# EAGLE design Dimmer_atmega328 (EAGLE 6.1)

## Sheet 1 of 4
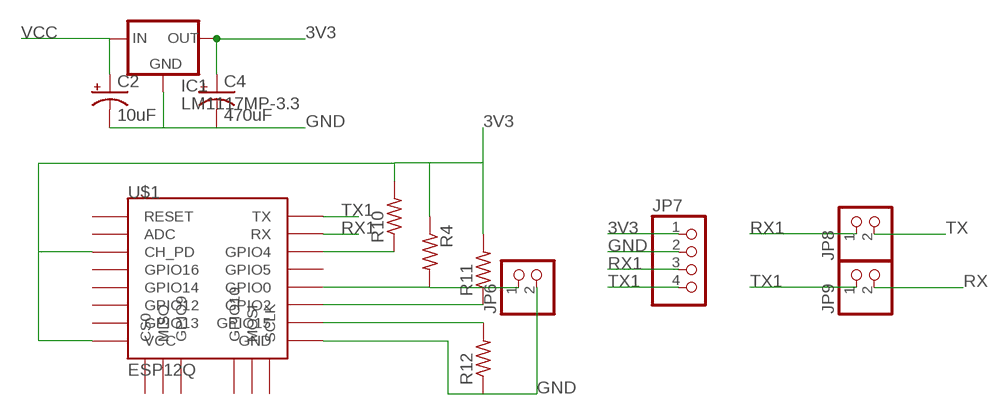
[diagram p0: schematic, sheet 1]

### Parts
C2  10uF  CPOL-USE2.5-6  [E2,5-6]
C4  470uF  CPOL-USE5-8.5  [E5-8,5]
IC1  LM1117MP-3.3  [SOT223]
JP6  PINHD-1X2  [1X02]
JP7  PINHD-1X4  [1X04]
JP8  PINHD-1X2  [1X02]
JP9  PINHD-1X2  [1X02]
R4  R-US_0207/10  [0207/10]
R10  R-US_0207/10  [0207/10]
R11  R-US_0207/10  [0207/10]
R12  R-US_0207/10  [0207/10]
U$1  ESP12Q  [ESP12Q]

### Nets
3V3: C4.+ IC1.2(OUT) IC1.4(OUT) JP7.1 R4.1 R10.2 R11.2 U$1.CH_PD U$1.VCC
GND: C2.- C4.- IC1.1(GND) JP6.2 JP7.2 R12.1 U$1.GND ; also sheet 2,3,4
N$10: JP6.1 R4.2 U$1.GPIO0
N$11: R10.1 U$1.GPIO4
N$21: R11.1 U$1.GPIO2
N$22: R12.2 U$1.GPIO15
RX: JP9.2 ; also sheet 2
RX1: JP7.3 JP8.1 U$1.RX
TX: JP8.2 ; also sheet 2
TX1: JP7.4 JP9.1 U$1.TX
VCC: C2.+ IC1.3(IN) ; also sheet 2,3
Unconnected: U$1.ADC U$1.CS0 U$1.GPIO5 U$1.GPIO9 U$1.GPIO10 U$1.GPIO12 U$1.GPIO13 U$1.GPIO14 U$1.GPIO16 U$1.MISO U$1.MOSI U$1.RESET U$1.SCLK

## Sheet 2 of 4: controller
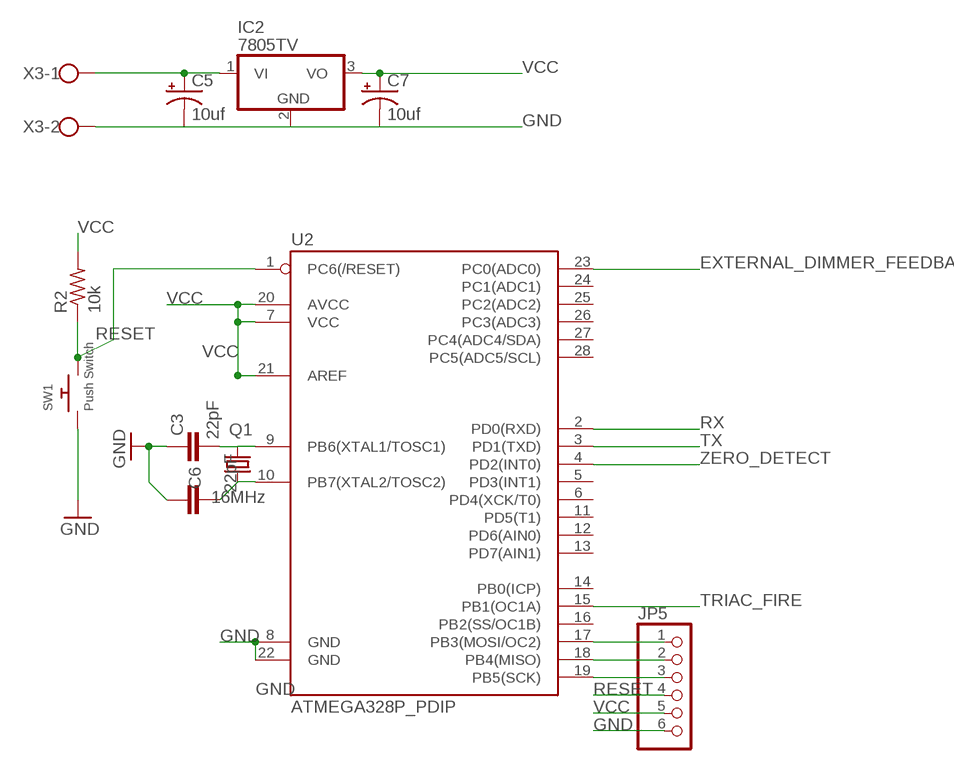
[diagram p1: schematic, sheet 2]

### Parts
C3  22pF  CAPPTH  [CAP-PTH-SMALL]
C5  10uf  CPOL-USE2.5-6  [E2,5-6]
C6  22pF  CAPPTH  [CAP-PTH-SMALL]
C7  10uf  CPOL-USE2.5-6  [E2,5-6]
IC2  7805TV  [TO220V]
JP5  PINHD-1X6  [1X06]
Q1  16MHz  CRYSTALHC49US  [HC49US]
R2  10k  R-US_0207/10  [0207/10]
SW1  Push Switch  SWITCH_PUSHBUTTONEVQ-PE  [TACT_PANA-EVQ]
U2  ATMEGA328P_PDIP  [DIL28-3]
X3  W237-102  [W237-102]

### Nets
EXTERNAL_DIMMER_FEEDBACK: U2.23(PC0(ADC0)) ; also sheet 4
GND: C3.1 C5.- C6.1 C7.- IC2.2(GND) JP5.6 SW1.P$1 U2.8(GND) U2.22(GND) X3.2 ; also sheet 1,3,4
N$2: JP5.3 U2.19(PB5(SCK))
N$3: JP5.2 U2.18(PB4(MISO))
N$4: JP5.1 U2.17(PB3(MOSI/OC2))
N$5: C3.2 Q1.2 U2.9(PB6(XTAL1/TOSC1))
N$6: C6.2 Q1.1 U2.10(PB7(XTAL2/TOSC2))
N$7: C5.+ IC2.1(VI) X3.1
RESET: JP5.4 R2.1 SW1.P$2 U2.1(PC6(/RESET))
RX: U2.2(PD0(RXD)) ; also sheet 1
TRIAC_FIRE: U2.15(PB1(OC1A)) ; also sheet 3
TX: U2.3(PD1(TXD)) ; also sheet 1
VCC: C7.+ IC2.3(VO) JP5.5 R2.2 U2.7(VCC) U2.20(AVCC) U2.21(AREF) ; also sheet 1,3
ZERO_DETECT: U2.4(PD2(INT0)) ; also sheet 3
Unconnected: U2.5(PD3(INT1)) U2.6(PD4(XCK/T0)) U2.11(PD5(T1)) U2.12(PD6(AIN0)) U2.13(PD7(AIN1)) U2.14(PB0(ICP)) U2.16(PB2(SS/OC1B)) U2.24(PC1(ADC1)) U2.25(PC2(ADC2)) U2.26(PC3(ADC3)) U2.27(PC4(ADC4/SDA)) U2.28(PC5(ADC5/SCL))

## Sheet 3 of 4: dimmer
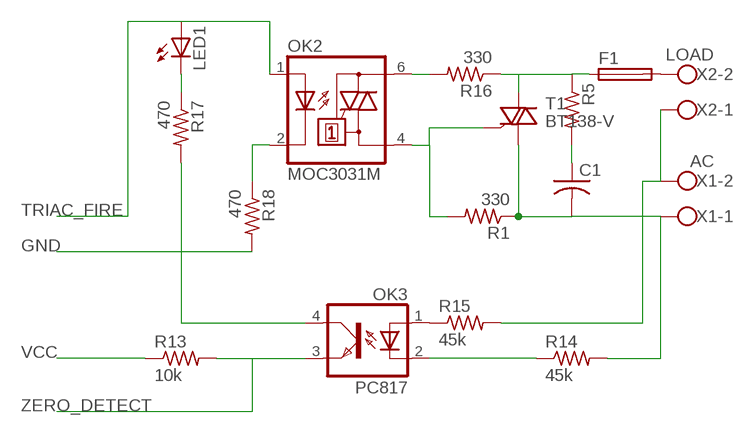
[diagram p2: schematic, sheet 3]

### Parts
C1  C-US150-091X182  [C150-091X182]
F1  GSH15  [GSH15]
LED1  LED3MM  [LED3MM]
OK2  MOC3031M  [DIL06]
OK3  PC817  [DIL04]
R1  330  R-US_0207/10  [0207/10]
R5  R-US_0411/15  [0411/15]
R13  10k  R-US_0207/10  [0207/10]
R14  45k  R-US_0207/10  [0207/10]
R15  45k  R-US_0207/10  [0207/10]
R16  330  R-US_0207/10  [0207/10]
R17  470  R-US_0207/10  [0207/10]
R18  470  R-US_0207/10  [0207/10]
T1  BT138-V  [TO220BV]
X1  AC  W237-102  [W237-102]
X2  LOAD  W237-102  [W237-102]

### Nets
GND: OK3.4(COL) R17.2 R18.2 ; also sheet 1,2,4
N$1: OK3.1(A) R15.1
N$8: LED1.K(C) R17.1
N$9: OK2.2(C) R18.1
N$12: OK2.6(A2) R16.2
N$13: C1.1 R5.2
N$14: F1.1 R5.1 R16.1 T1.T2(A2)
N$15: R15.2 X1.2 X2.1
N$16: C1.2 R1.1 R14.2 T1.T1(A1) X1.1
N$17: OK2.4(A1) R1.2 T1.G
N$18: F1.2 X2.2
N$20: OK3.2(C) R14.1
TRIAC_FIRE: LED1.A OK2.1(A) ; also sheet 2
VCC: R13.1 ; also sheet 1,2
ZERO_DETECT: OK3.3(EMIT) R13.2 ; also sheet 2

## Sheet 4 of 4: external dimmer feedback
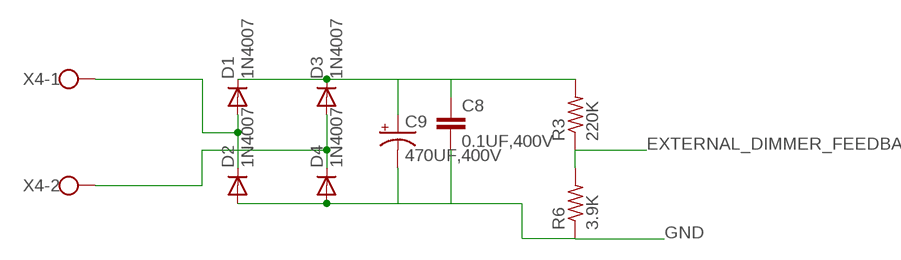
[diagram p3: schematic, sheet 4]

### Parts
C8  0.1UF,400V  C-EU102-054X133  [C102-054X133]
C9  470UF,400V  CPOL-USE7.5-18  [E7,5-18]
D1  1N4007  1N4004  [DO41-10]
D2  1N4007  1N4004  [DO41-10]
D3  1N4007  1N4004  [DO41-10]
D4  1N4007  1N4004  [DO41-10]
R3  220K  R-US_0207/10  [0207/10]
R6  3.9K  R-US_0207/10  [0207/10]
X4  W237-102  [W237-102]

### Nets
EXTERNAL_DIMMER_FEEDBACK: R3.1 R6.2 ; also sheet 2
GND: C8.2 C9.- D2.A D4.A R6.1 ; also sheet 1,2,3
N$30: D1.A D2.C X4.1
N$31: D3.A D4.C X4.2
N$32: C8.1 C9.+ D1.C D3.C R3.2

## Library data of the parts
C1 = rcl:C-US: CAPACITOR, American symbol
C2 C4 C5 C7 = rcl:CPOL-US: POLARIZED CAPACITOR, American symbol
C3 C6 = SparkFun:CAP: Capacitor Standard 0603 ceramic capacitor, and 0.1" leaded capacitor.
C8 = amit_rcl:C-EU: CAPACITOR, European symbol
C9 = amit_rcl:CPOL-US: POLARIZED CAPACITOR, American symbol
D1-D4 = amit_diode_1N4004:1N4004: DIODE general purpose rectifier, 1 A
F1 = fuse:GSH15: FUSE HOLDER grid 15mm, 19649 Wickmann; MPN: 64900001039; OC_FARNELL: 1271673; OC_NEWARK: 02P0318
IC1 = lm1117_10:LM1117?-*: 800mA Low-Dropout Linear Regulator Source: http://www.ti.com/lit/ds/symlink/lm1117-n.pdf; MF: Texas Instruments; MPN: LM1117MP-3.3; OC_FARNELL: 9778195; OC_NEWARK: 28X3416
IC2 = linear:78*: Positive VOLTAGE REGULATOR Source: http://cache.national.com/ds/LM/LM78L05.pdf http://www.fairchildsemi.com/ds/LM/LM7805.pdf
JP5 = pinhead:PINHD-1X6: PIN HEADER
JP6 JP8 JP9 = pinhead:PINHD-1X2: PIN HEADER
JP7 = pinhead:PINHD-1X4: PIN HEADER
LED1 = led:LED: LED OSRAM: - CHIPLED LG R971, LG N971, LY N971, LG Q971, LY Q971, LO R971, LY R971 LH N974, LH R974 LS Q976, LO Q976, LY Q976 LO Q996 - Hyper CHIPLED LW Q18S LB Q993, LB Q99A, LB R99A - SideLED LS A670, LO A670, LY A670, LG A670, LP A670 LB A673, LV A673, LT A673, LW A673 LH A674 LY A675 LS A676, LA A676, LO A676, LY A676, LW A676 LS A679, LY A679, LG A679 - Hyper Micro SIDELED® LS Y876, LA Y876, LO Y876, LY Y876 LT Y87S - SmartLED LW L88C, LW L88S LB L89C, LB L89S, LG L890 LS L89K, LO L89K, LY L89K LS L896, LA L896, LO L896, LY L896 - TOPLED LS T670, LO T670, LY T670, LG T670, LP T670 LSG T670, LSP T670, LSY T670, LOP T670, LYG T670 LG T671, LOG T671, LSG T671 LB T673, LV T673, LT T673, LW T673 LH T674 LS T676, LA T676, LO T676, LY T676, LB T676, LH T676, LSB T676, LW T676 LB T67C, LV T67C, LT T67C, LS T67K, LO T67K, LY T67K, LW E67C LS E67B, LA E67B, LO E67B, LY E67B, LB E67C, LV E67C, LT E67C LW T67C LS T679, LY T679, LG T679 LS T770, LO T770, LY T770, LG T770, LP T770 LB T773, LV T773, LT T773, LW T773 LH T774 LS E675, LA E675, LY E675, LS T675 LS T776, LA T776, LO T776, LY T776, LB T776 LHGB T686 LT T68C, LB T68C - Hyper Mini TOPLED® LB M676 - Mini TOPLED Santana® LG M470 LS M47K, LO M47K, LY M47K Source: http://www.osram.convergy.de LUXEON: - LUMILED® LXK2-PW12-R00, LXK2-PW12-S00, LXK2-PW14-U00, LXK2-PW14-V00 LXK2-PM12-R00, LXK2-PM12-S00, LXK2-PM14-U00 LXK2-PE12-Q00, LXK2-PE12-R00, LXK2-PE12-S00, LXK2-PE14-T00, LXK2-PE14-U00 LXK2-PB12-K00, LXK2-PB12-L00, LXK2-PB12-M00, LXK2-PB14-N00, LXK2-PB14-P00, LXK2-PB14-Q00 LXK2-PR12-L00, LXK2-PR12-M00, LXK2-PR14-Q00, LXK2-PR14-R00 LXK2-PD12-Q00, LXK2-PD12-R00, LXK2-PD12-S00 LXK2-PH12-R00, LXK2-PH12-S00 LXK2-PL12-P00, LXK2-PL12-Q00, LXK2-PL12-R00 Source: www.luxeon.com KINGBRIGHT: KA-3528ASYC Source: www.kingbright.com
OK2 = optocoupler:MOC30*: 6-Pin DIP Zero-Cross Optoisolators Triac Driver Output (250/400 Volt Peak) Source: Data sheet <http://www.fairchildsemi.com/ds/MO/MOC3031M.pdf> The old path of data sheet not more available 2013-05-06.; MF: FAIRCHILD SEMICONDUCTOR; MPN: MOC3031M; OC_FARNELL: 9875964; OC_NEWARK: 78K6089
OK3 = optocoupler:PC817: SHARP OPTO COUPLER; MPN: PC817X4J000F; OC_FARNELL: 9707727; OC_NEWARK: 97K7059
Q1 = SparkFun:CRYSTAL: Crystals Various standard crystals. Proven footprints. Spark Fun Electronics SKU : COM-00534
R1 R2 R5 R13-R18 = resistor:R-US_: RESISTOR, American symbol
R3 R6 = amit_rcl:R-US_: RESISTOR, American symbol
R4 R10-R12 = rcl:R-US_: RESISTOR, American symbol
SW1 = adafruit:SWITCH_PUSHBUTTON: Buttons SOFTTOUCHSMD_SJ - Soft touch temporary push button (Super Junk Akihabara) Compatible with SKPMANE010 [Mouser: 688-SKPMAN] C&K_KSS = Digikey: KSS221GLFS
T1 = triac:BT138: TRIAC Source: http://www.semiconductors.philips.com BT138_SERIES_2.pdf
U2 = SparkFun-DigitalIC:ATMEGA328P_PDIP: uC used in the Arduino 32kb flash, 1k EEPROM, 2k SRAM This is the through-hole version of this chip.
U$1 = esp826612q:ESP12Q: ESP8266 Wifi module 12-Q
X1-X3 = con-wago-500:W237-102: WAGO SCREW CLAMP; MPN: 237-102; OC_FARNELL: unknown; OC_NEWARK: 70K9898
X4 = amit_screw_terminal_23:W237-102: WAGO SCREW CLAMP; MPN: 237-102; OC_FARNELL: unknown; OC_NEWARK: 70K9898

## Board
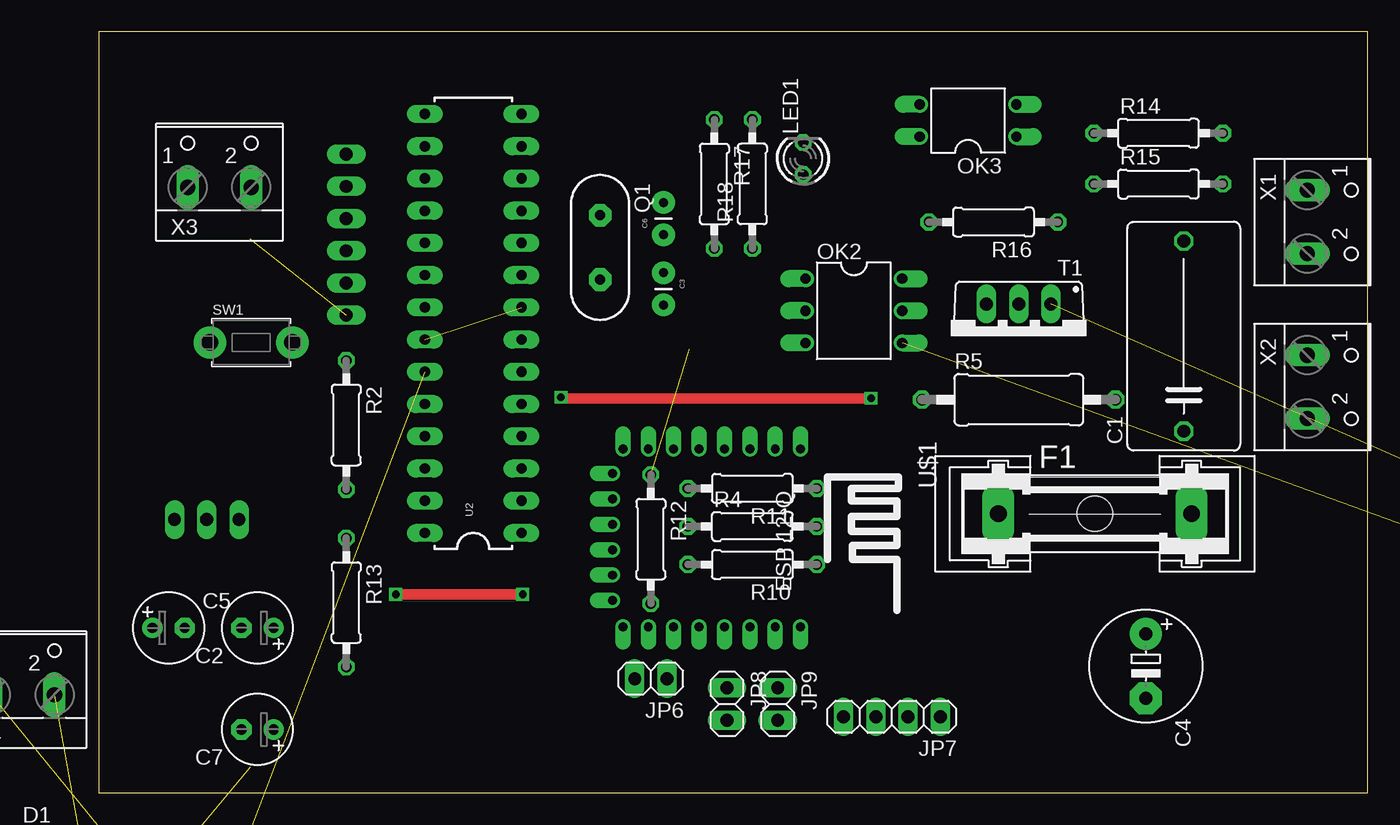
[diagram p4: board, top side]
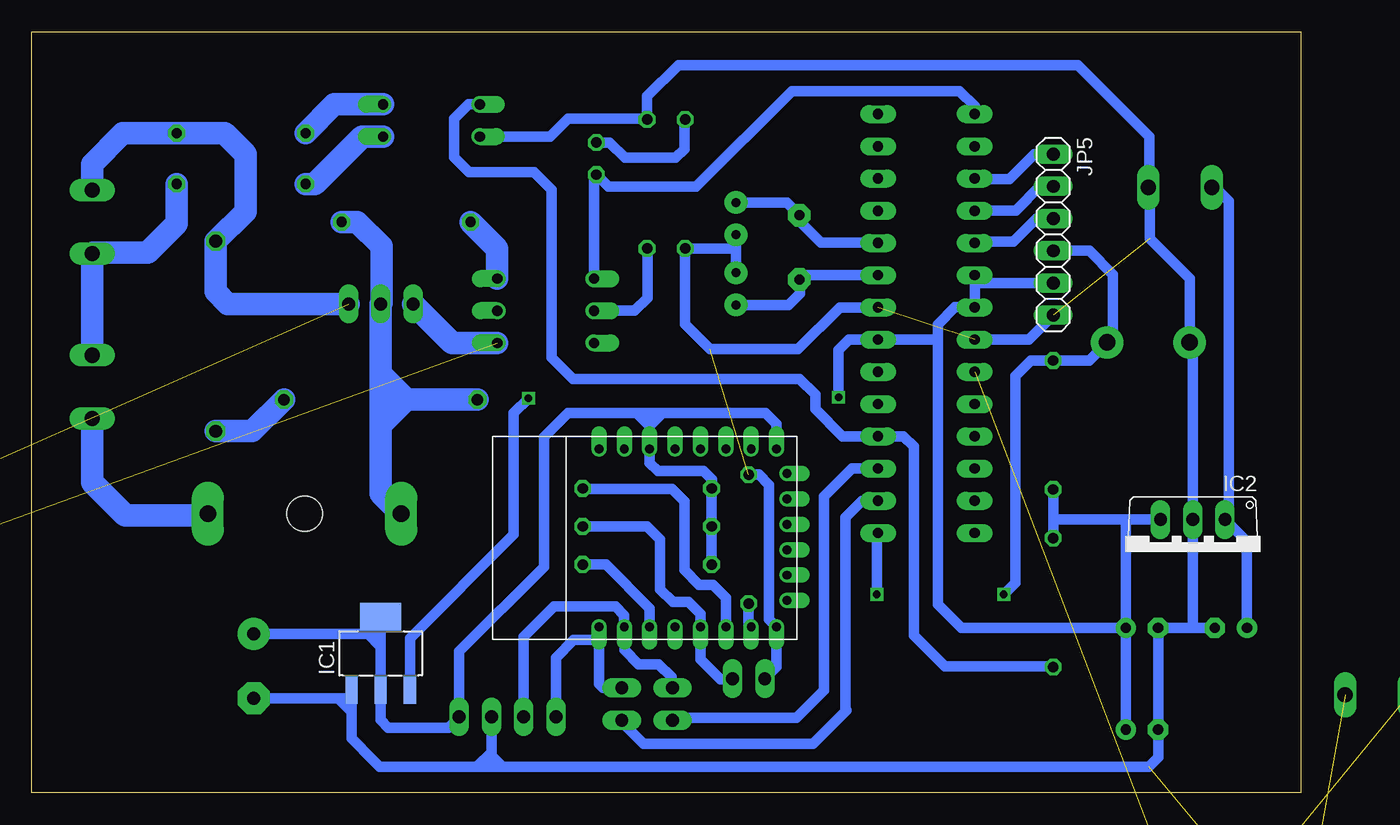
[diagram p5: board, bottom side, seen from below]

Size 100 x 60 mm. Coordinates in mm from the lower left corner, seen from the top.
Outline: 0,60 0,0 100,0 100,60 0,60
Copper layers (1*16): Top 0.035mm / dielectric 1.5mm / Bottom 0.035mm
Design rules: minimum track width 10mil, minimum drill 24mil, track to track 8mil, track to pad 8mil, pad to pad 8mil, via to via 8mil, smd to smd 8mil, copper to edge 40mil, drill to drill 8mil, minimum pad ring 10mil, minimum via ring 8mil, stop-mask expansion 4mil, vias tented up to drill 0mil, thermal gap 10mil

### Footprints (pad centres in the part's own frame; a part is rotated, then mirrored left to right if it is on the bottom)
C150-091X182 = drill 1.016 octagon: 1 -7.493,0; 2 7.493,0
E2,5-6 = drill 0.813 pad 1.6: + -1.27,0 | drill 0.813 pad 1.6 octagon: - 1.27,0
CAP-PTH-SMALL = drill 0.7 pad 1.778: 1 0,0; 2 2.54,0
E5-8,5 = drill 1.016 pad 2.54: + -2.54,0 | drill 1.016 pad 2.54 octagon: - 2.54,0
C102-054X133 = drill 1 pad 1.93 octagon: 1 -5.08,0; 2 5.08,0
E7,5-18 = drill 1.016 pad 3.15: + -3.81,0 | drill 1.016 pad 3.15 octagon: - 3.81,0
DO41-10 = drill 1.1 pad 1.93 octagon: A 5.08,0; C -5.08,0
GSH15 = drill 1.321 pad 2.54 long: 1 -7.62,0; 2 7.62,0 | hole 2.794: 0,0
SOT223 = smd 0.95 x 2.15: 1 -2.3,-2.9; 2 0,-2.9; 3 2.3,-2.9 | smd 3.25 x 2.15: 4 0,2.9
TO220V = drill 1.016 long: 1 -2.54,-2.54; 2 0,-2.54; 3 2.54,-2.54
1X06 = drill 1.016 long: 1 -6.35,0; 2 -3.81,0; 3 -1.27,0; 4 1.27,0; 5 3.81,0; 6 6.35,0
1X02 = drill 1.016 long: 1 -1.27,0; 2 1.27,0
1X04 = drill 1.016 long: 1 -3.81,0; 2 -1.27,0; 3 1.27,0; 4 3.81,0
LED3MM = drill 0.813 octagon: A -1.27,0; K 1.27,0
DIL06 = drill 0.813 offset: 1 -2.54,-3.81; 2 0,-3.81; 3 2.54,-3.81; 4 2.54,3.81; 5 0,3.81; 6 -2.54,3.81
DIL04 = drill 0.813 offset: 1 -1.27,-3.81; 2 1.27,-3.81; 3 1.27,3.81; 4 -1.27,3.81
HC49US = drill 0.8 pad 1.778 octagon: 1 -2.54,0; 2 2.54,0
0207/10 = drill 0.813 octagon: 1 -5.08,0; 2 5.08,0
0411/15 = drill 0.914 octagon: 1 -7.62,0; 2 7.62,0
TACT_PANA-EVQ = drill 1.3 pad 2.54: P$1 -3.25,0; P$2 3.25,0
TO220BV = drill 1.016 long: G 2.54,-2.54; T1 -2.54,-2.54; T2 0,-2.54
DIL28-3 = drill 0.813 pad 1.422 long: 1 -16.51,-3.81; 2 -13.97,-3.81; 3 -11.43,-3.81; 4 -8.89,-3.81; 5 -6.35,-3.81; 6 -3.81,-3.81; 7 -1.27,-3.81; 8 1.27,-3.81; 9 3.81,-3.81; 10 6.35,-3.81; 11 8.89,-3.81; 12 11.43,-3.81; 13 13.97,-3.81; 14 16.51,-3.81; 15 16.51,3.81; 16 13.97,3.81; 17 11.43,3.81; 18 8.89,3.81; 19 6.35,3.81; 20 3.81,3.81; 21 1.27,3.81; 22 -1.27,3.81; 23 -3.81,3.81; 24 -6.35,3.81; 25 -8.89,3.81; 26 -11.43,3.81; 27 -13.97,3.81; 28 -16.51,3.81
ESP12Q = drill 0.7 offset: ADC -7.1,3.8; CH_PD -7.1,1.8; CS0 -5.165,-9.005; GND 6.9,-8.2; GPIO0 6.9,-2.2; GPIO2 6.9,-4.2; GPIO4 6.9,1.8; GPIO5 6.9,-0.2; GPIO9 -1.165,-9.005; GPIO10 0.835,-9.005; GPIO12 -7.1,-4.2; GPIO13 -7.1,-6.2; GPIO14 -7.1,-2.2; GPIO15 6.9,-6.2; GPIO16 -7.1,-0.2; MISO -3.165,-9.005; MOSI 2.835,-9.005; RESET -7.1,5.8; RX 6.9,3.8; SCLK 4.835,-9.005; TX 6.9,5.8; VCC -7.1,-8.2
W237-102 = drill 1.194 long: 1 -2.5,-1.27; 2 2.5,-1.27

### Placement (x,y rotation side)
C1  85.5,36 90 top
C2  12.5,13 180 top
C3  44.5,41 270 top
C4  82.5,10 270 top
C5  5.5,13 0 top
C6  44.5,44 90 top
C7  12.5,5 180 top
C8  -4,-33 0 top  (outside the outline)
C9  -2,-45 0 top  (outside the outline)
D1  -4,-4 0 top  (outside the outline)
D2  -4,-11 0 top  (outside the outline)
D3  -4,-18 0 top  (outside the outline)
D4  -4,-25 0 top  (outside the outline)
F1  78.5,22 0 top
IC1  72.5,11 0 bottom
IC2  8.5,19 180 bottom
JP5  19.5,44 270 bottom
JP6  43.5,9 180 top
JP7  62.5,6 180 top
JP8  49.5,7 270 top
JP9  53.5,7 270 top
LED1  55.5,50 90 top
OK2  59.5,38 270 top
OK3  68.5,53 90 top
Q1  39.5,43 270 top
R1  115.88,18.23 180 top  (outside the outline)
R2  19.5,29 270 top
R3  -4,-58 0 top  (outside the outline)
R4  51.5,21 0 top
R5  72.5,31 0 top
R6  -4,-63 0 top  (outside the outline)
R10  51.5,18 180 top
R11  51.5,24 180 top
R12  43.5,20 270 top
R13  19.5,15 270 top
R14  83.5,52 0 top
R15  83.5,48 0 top
R16  70.5,45 180 top
R17  48.5,48 270 top
R18  51.5,48 90 top
SW1  12,35.5 0 top
T1  72.5,36 180 top
U2  29.5,37 90 top
U$1  49.5,20 270 top
X1  96.5,45 270 top
X2  96.5,32 270 top
X3  9.5,49 0 top
X4  -6,9 0 top  (outside the outline)

### Tracks (layer width: path | path; a pad name or v marks a point on that pad's centre or on a via)
3V3
  Bottom 0.813: R10.2 R4.1 R11.2 46.4,24.02 46.4,24.7 47.06,25.36 50.64,25.36 51.3,26.02 U$1.CH_PD 51.3,29.84 51.18,29.96 | IC1.4 72.5,12.71 | 72.5,12.71 IC1.2 72.5,5.74 71.9,5.14 67.17,5.14 JP7.1 66.31,11.14 59.64,17.82 59.64,28.05 57.74,29.96 51.18,29.96 | C4.+ 72.67,12.54 72.5,12.71 | U$1.VCC 41.3,29.09 42.16,29.96 51.18,29.96
EXTERNAL_DIMMER_FEEDBACK  (2 unrouted)
GND  (8 unrouted)
  Bottom 0.813: JP6.2 41.3,9.93 U$1.GND 41.88,13.68 41.88,24.27 42.69,25.08 R12.1 | IC1.1 74.8,7.46 | 74.8,7.46 74.8,4.28 73.1,2.58 73.08,2.58 72.57,2.07 63.81,2.07 | JP7.2 63.77,2.1 63.81,2.07 | C4.- 74.8,7.46 | 63.81,2.07 11.98,2.07 11.23,2.82 11.23,4.78 11.28,4.83 11.28,4.95 C7.- C2.- 8.31,13 | C6.1 44.5,42.82 | 44.5,42.82 C3.1 44.52,40.98 | U2.8 36.31,38.27 39.6,34.98 46.53,34.98 48.5,36.95 R17.2 44.6,42.92 44.5,42.82 | OK3.4 59.14,51.73 57.73,53.14 51.56,53.14 R18.2 51.5,54.93 49.05,57.38 17.55,57.38 11.91,51.74 11.91,47.82 X3.2 11.89,47.62 11.89,43.69 8.75,40.55 SW1.P$1 8.5,35.25 IC2.2 8.5,13.19 8.31,13 | C5.- 8.31,13 | U2.22 21.42,35.73 JP5.6
N$1
  Bottom 1.778: OK3.1 73.95,51.73 77.7,47.98 78.4,47.98 R15.1
N$2
  Bottom 0.813: JP5.3 20.83,45.27 22.63,43.47 25.57,43.47 U2.19
N$3
  Bottom 0.813: JP5.2 20.55,47.81 22.45,45.91 25.67,45.91 U2.18
N$4
  Bottom 0.813: JP5.1 20.98,50.35 22.96,48.38 25.64,48.38 U2.17
N$5
  Bottom 0.813: U2.9 39.15,40.81 Q1.2 39.47,40.43 39.47,39.35 40.37,38.46 C3.2
N$6
  Bottom 0.813: U2.10 33.33,43.37 37.8,43.37 39.5,45.07 Q1.1 40.5,46.54 C6.2
N$7
  Bottom 0.813: X3.1 6.76,47.73 5.66,46.63 5.66,21.84 IC2.1 4.23,19.81 C5.+
N$8
  Bottom 0.813: LED1.K 54.45,51.27 53.24,50.06 49.25,50.06 48.56,50.75 48.56,53.02 R17.1
N$9
  Bottom 0.813: OK2.2 52.5,38 51.49,39.01 51.49,42.91 R18.1
N$10
  Bottom 0.813: JP6.1 44.81,8.96 45.72,8.96 47.3,10.54 U$1.GPIO0 47.3,14.1 48.23,15.04 49.45,15.04 50.47,16.05 50.47,19.96 51.51,21.01 R4.2
N$11
  Bottom 0.813: U$1.GPIO4 51.3,14.55 54.75,18 R10.1
N$12
  Bottom 1.778: OK2.6 63.31,42.89 R16.2
N$13
  Bottom 1.778: C1.1 82.61,28.51 R5.2
N$14
  Bottom 1.778: R16.1 74.34,45 72.44,43.09 72.44,38.6 T1.T2 72.5,33 | 72.5,33 72.5,31.18 | 72.5,31.18 72.5,29 | 72.5,29 72.5,23.62 F1.1 | R5.1 70,31 70.5,31 | 70.5,31 72.32,31 72.5,31.18 | 70.5,31 72.5,33 | 70.5,31 72.5,29
N$15
  Bottom 1.778: X2.1 X1.2 95.14,42.59 90.88,42.59 88.58,44.88 R15.2
N$16  (1 unrouted)
  Bottom 1.778: T1.T1 84.55,38.54 85.52,39.51 85.52,43.48 C1.2 83.16,45.84 83.16,50.36 84.8,52 R14.2 92.82,52 95.25,49.57 95.25,47.52 X1.1
N$17  (1 unrouted)
  Bottom 1.778: OK2.4 66.88,35.46 T1.G
N$18
  Bottom 1.778: X2.2 95.23,24.46 92.63,21.86 86.26,21.86 F1.2
N$19
  Bottom 0.813: 62.92,2.08 63.8,2.97 63.8,3.05 63.93,3.05 64.77,2.21
N$20
  Bottom 1.778: OK3.2 76.15,54.27 R14.1
N$21
  Bottom 0.813: U$1.GPIO2 45.3,15.38 46.33,16.41 47.4,16.41 48.56,17.58 48.56,22.99 49.53,23.95 56.53,23.95 R11.1
N$22
  Bottom 0.813: R12.2 43.5,13.3 U$1.GPIO15
N$23
  Bottom 0.813: 75.92,7.44 75.87,7.44 74.95,6.53
N$24
  Bottom 0.813: 73.58,12.6 72.49,11.51
N$25
  Bottom 0.813: 50.24,29.95 50.29,29.95 51.28,28.96 51.33,28.96 52.25,29.87
N$30  (2 unrouted)
N$31  (2 unrouted)
N$32  (4 unrouted)
RESET  (via drill 0.6)
  Top 0.813: v23.39,15.65 v33.4,15.65
  Bottom 0.813: JP5.4 16.64,42.73 14.78,40.87 14.78,35.97 SW1.P$2 | SW1.P$2 15.39,35.36 | SW1.P$2 16.67,34.08 R2.1 21.24,34.08 22.48,32.84 22.48,16.56 v23.39,15.65 | v33.4,15.65 33.4,20.4 U2.1
RX
  Bottom 0.813: U2.2 34.59,23.03 35.89,21.73 35.89,6.42 | JP9.2 53.5,5.6 51.77,3.87 38.43,3.87 35.89,6.42 | 35.89,6.42 35.79,6.51
RX1
  Bottom 0.813: JP8.1 49.58,8.35 49.58,9.13 50.59,10.15 52.19,10.15 53.3,11.26 U$1.RX 53.31,14.01 54,14.7 58.85,14.7 61.23,12.31 JP7.3
TRIAC_FIRE
  Bottom 0.813: OK2.1 55.69,48.54 LED1.A 54.55,47.78 47.65,47.78 40.11,55.32 26.9,55.32 25.69,54.11 U2.15
TX
  Bottom 0.813: U2.3 35.35,25.57 37.56,23.36 37.56,8.09 39.75,5.91 49.32,5.91 JP8.2
TX1
  Bottom 0.813: U$1.TX 55.3,11.88 | 55.3,11.88 55.3,8.61 54.96,8.27 JP9.1 | JP9.1 | JP7.4 58.69,10.66 57.3,12.05 55.48,12.05 55.3,11.88
VCC  (via drill 0.6)
  Top 0.813: v60.85,31.1 36.5,31.1 v36.42,31.18
  Bottom 0.813: U2.20 25.69,40.13 | 25.69,40.13 U2.21 27.25,38.28 28.6,36.93 28.6,35.99 | IC1.3 70.2,12.18 62.02,20.36 62.02,29.94 v60.85,31.1 | v36.42,31.18 36.42,34.91 35.58,35.75 33.33,35.75 U2.7 28.86,35.73 28.6,35.99 | C2.+ C7.+ | JP5.5 25.63,40.19 25.69,40.13 | R2.2 19.5,21.51 | 19.5,21.51 R13.1 | IC2.3 13.59,21.54 | 13.59,21.54 19.47,21.54 19.5,21.51 | C2.+ 26.74,13 28.6,14.86 28.6,35.99 | C2.+ 13.77,21.36 13.59,21.54
ZERO_DETECT
  Bottom 0.813: OK3.3 65.58,54.27 66.7,53.15 66.7,50.1 65.53,48.94 60.42,48.94 59.05,47.56 59.05,34.33 57.35,32.63 39.49,32.63 38.25,31.38 38.25,30.27 36.09,28.11 U2.4 31.29,28.11 30.48,27.3 30.48,12.42 28.02,9.96 19.54,9.96 R13.2